# Altium schematic sheet vesc_mcu.SchDoc
size A4; SheetNumber: 2; SheetTotal: 5
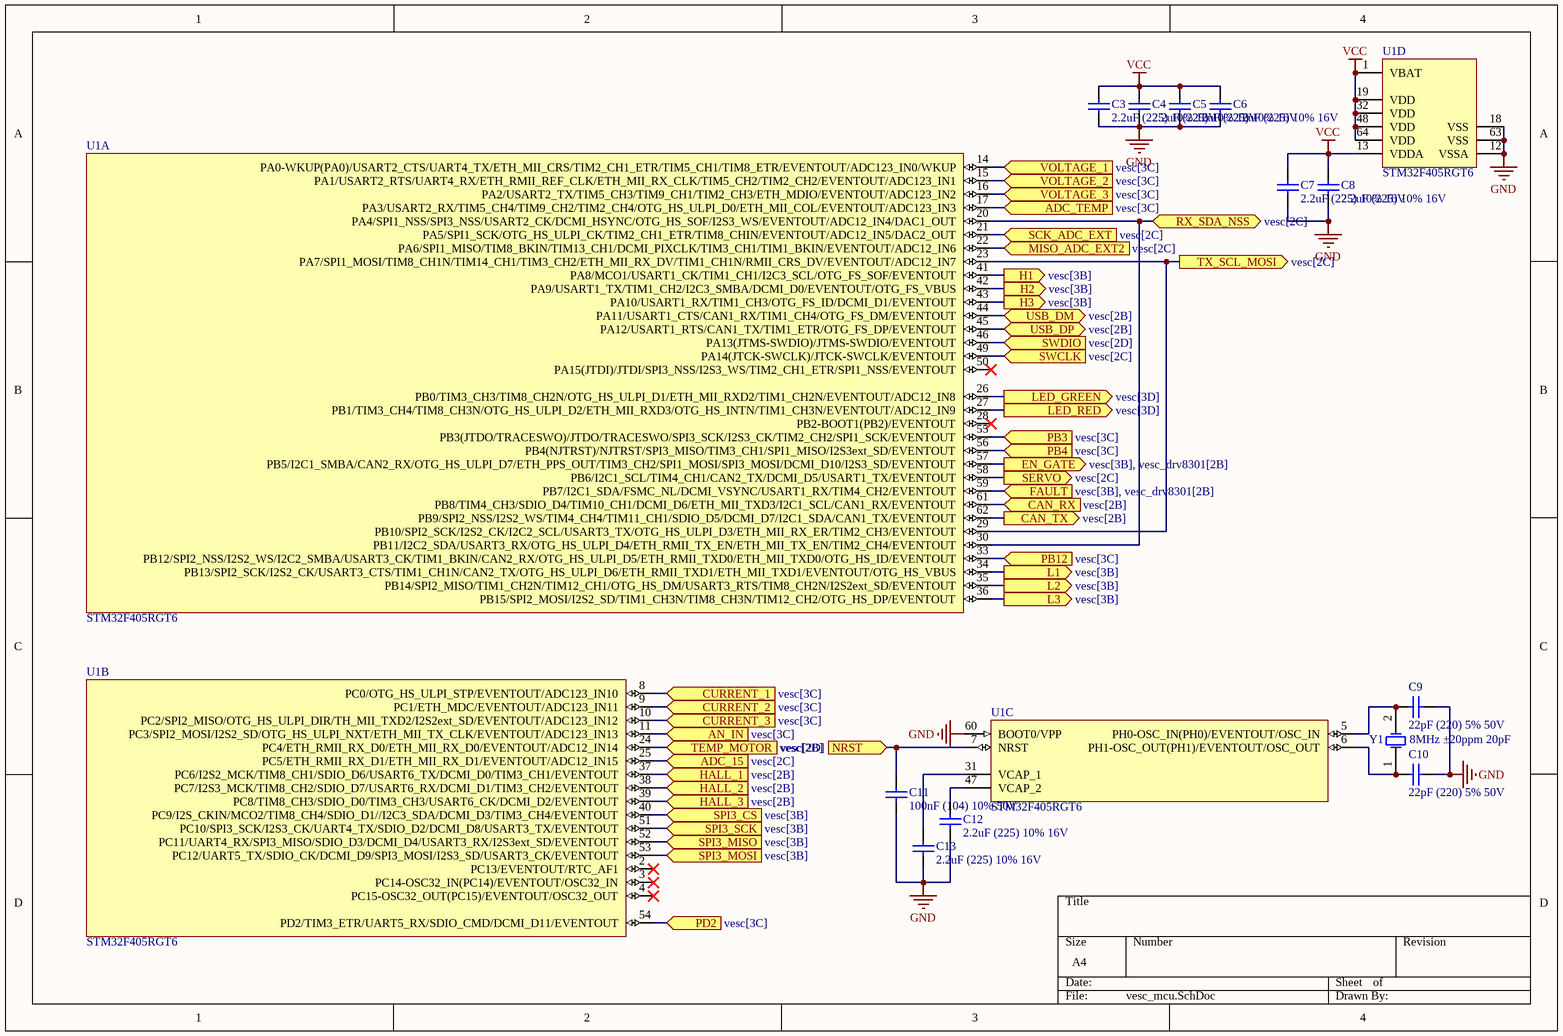
[diagram p0: vesc_mcu.SchDoc]

## Parts
C3  2.2uF (225) 10% 16V  [0603_C]
C4  2.2uF (225) 10% 16V  [0603_C]
C5  2.2uF (225) 10% 16V  [0603_C]
C6  2.2uF (225) 10% 16V  [0603_C]
C7  2.2uF (225) 10% 16V  [0603_C]
C8  2.2uF (225) 10% 16V  [0603_C]
C9  22pF (220) 5% 50V  [0603_C]
C10  22pF (220) 5% 50V  [0603_C]
C11  100nF (104) 10% 50V  [0603_C]
C12  2.2uF (225) 10% 16V  [0603_C]
C13  2.2uF (225) 10% 16V  [0603_C]
U1  STM32F405RGT6  [LQFP-64_10x10x05P]  (parts A,B,C,D of 4)
Y1  8MHz ±20ppm 20pF  [SMD-5032_2P]

## Ports
ADC_15 (in, see vesc[2C]), ADC_TEMP (in, see vesc[3C]), AN_IN (in, see vesc[3C]), CAN_RX (in, see vesc[2B]), CAN_TX (out, see vesc[2B]), CURRENT_1 (in, see vesc[3C]), CURRENT_2 (in, see vesc[3C]), CURRENT_3 (in, see vesc[3C]), EN_GATE (out, see vesc[3B], vesc_drv8301[2B]), FAULT (in, see vesc[3B], vesc_drv8301[2B]), H1 (out, see vesc[3B]), H2 (out, see vesc[3B]), H3 (out, see vesc[3B]), HALL_1 (in, see vesc[2B]), HALL_2 (in, see vesc[2B]), HALL_3 (in, see vesc[2B]), L1 (out, see vesc[3B]), L2 (out, see vesc[3B]), L3 (out, see vesc[3B]), LED_GREEN (out, see vesc[3D]), LED_RED (out, see vesc[3D]), MISO_ADC_EXT2 (in, see vesc[2C]), NRST (in, see vesc[2D]), PB3 (in, see vesc[3C]), PB4 (in, see vesc[3C]), PB12 (in, see vesc[3C]), PD2 (in, see vesc[3C]), RX_SDA_NSS (bidir, see vesc[2C]), SCK_ADC_EXT (in, see vesc[2C]), SERVO (out, see vesc[2C]), SPI3_CS (in, see vesc[3B]), SPI3_MISO (in, see vesc[3B]), SPI3_MOSI (in, see vesc[3B]), SPI3_SCK (in, see vesc[3B]), SWCLK (in, see vesc[2C]), SWDIO (in, see vesc[2D]), TEMP_MOTOR (in, see vesc[2B]), TX_SCL_MOSI (out, see vesc[2C]), USB_DM (bidir, see vesc[2B]), USB_DP (bidir, see vesc[2B]), VOLTAGE_1 (in, see vesc[3C]), VOLTAGE_2 (in, see vesc[3C]), VOLTAGE_3 (in, see vesc[3C])

## Nets
GND: C3.1 C4.1 C5.1 C6.1 C7.1 C8.1 C9.2 C10.2 C11.1 C12.1 C13.1 U1.12(VSSA) U1.18(VSS) U1.60(BOOT0/VPP) U1.63(VSS)
VCC: C3.2 C4.2 C5.2 C6.2 C7.2 C8.2 U1.1(VBAT) U1.13(VDDA) U1.19(VDD) U1.32(VDD) U1.48(VDD) U1.64(VDD)
ADC_15: U1.25(PC5/ETH_RMII_RX_D1/ETH_MII_RX_D1/EVENTOUT/ADC12_IN15) ; port ADC_15
ADC_TEMP: U1.17(PA3/USART2_RX/TIM5_CH4/TIM9_CH2/TIM2_CH4/OTG_HS_ULPI_D0/ETH_MII_COL/EVENTOUT/ADC123_IN3) ; port ADC_TEMP
AN_IN: U1.11(PC3/SPI2_MOSI/I2S2_SD/OTG_HS_ULPI_NXT/ETH_MII_TX_CLK/EVENTOUT/ADC123_IN13) ; port AN_IN
CAN_RX: U1.61(PB8/TIM4_CH3/SDIO_D4/TIM10_CH1/DCMI_D6/ETH_MII_TXD3/I2C1_SCL/CAN1_RX/EVENTOUT) ; port CAN_RX
CAN_TX: U1.62(PB9/SPI2_NSS/I2S2_WS/TIM4_CH4/TIM11_CH1/SDIO_D5/DCMI_D7/I2C1_SDA/CAN1_TX/EVENTOUT) ; port CAN_TX
CURRENT_1: U1.8(PC0/OTG_HS_ULPI_STP/EVENTOUT/ADC123_IN10) ; port CURRENT_1
CURRENT_2: U1.9(PC1/ETH_MDC/EVENTOUT/ADC123_IN11) ; port CURRENT_2
CURRENT_3: U1.10(PC2/SPI2_MISO/OTG_HS_ULPI_DIR/TH_MII_TXD2/I2S2ext_SD/EVENTOUT/ADC123_IN12) ; port CURRENT_3
EN_GATE: U1.57(PB5/I2C1_SMBA/CAN2_RX/OTG_HS_ULPI_D7/ETH_PPS_OUT/TIM3_CH2/SPI1_MOSI/SPI3_MOSI/DCMI_D10/I2S3_SD/EVENTOUT) ; port EN_GATE
FAULT: U1.59(PB7/I2C1_SDA/FSMC_NL/DCMI_VSYNC/USART1_RX/TIM4_CH2/EVENTOUT) ; port FAULT
H1: U1.41(PA8/MCO1/USART1_CK/TIM1_CH1/I2C3_SCL/OTG_FS_SOF/EVENTOUT) ; port H1
H2: U1.42(PA9/USART1_TX/TIM1_CH2/I2C3_SMBA/DCMI_D0/EVENTOUT/OTG_FS_VBUS) ; port H2
H3: U1.43(PA10/USART1_RX/TIM1_CH3/OTG_FS_ID/DCMI_D1/EVENTOUT) ; port H3
HALL_1: U1.37(PC6/I2S2_MCK/TIM8_CH1/SDIO_D6/USART6_TX/DCMI_D0/TIM3_CH1/EVENTOUT) ; port HALL_1
HALL_2: U1.38(PC7/I2S3_MCK/TIM8_CH2/SDIO_D7/USART6_RX/DCMI_D1/TIM3_CH2/EVENTOUT) ; port HALL_2
HALL_3: U1.39(PC8/TIM8_CH3/SDIO_D0/TIM3_CH3/USART6_CK/DCMI_D2/EVENTOUT) ; port HALL_3
L1: U1.34(PB13/SPI2_SCK/I2S2_CK/USART3_CTS/TIM1_CH1N/CAN2_TX/OTG_HS_ULPI_D6/ETH_RMII_TXD1/ETH_MII_TXD1/EVENTOUT/OTG_HS_VBUS) ; port L1
L2: U1.35(PB14/SPI2_MISO/TIM1_CH2N/TIM12_CH1/OTG_HS_DM/USART3_RTS/TIM8_CH2N/I2S2ext_SD/EVENTOUT) ; port L2
L3: U1.36(PB15/SPI2_MOSI/I2S2_SD/TIM1_CH3N/TIM8_CH3N/TIM12_CH2/OTG_HS_DP/EVENTOUT) ; port L3
LED_GREEN: U1.26(PB0/TIM3_CH3/TIM8_CH2N/OTG_HS_ULPI_D1/ETH_MII_RXD2/TIM1_CH2N/EVENTOUT/ADC12_IN8) ; port LED_GREEN
LED_RED: U1.27(PB1/TIM3_CH4/TIM8_CH3N/OTG_HS_ULPI_D2/ETH_MII_RXD3/OTG_HS_INTN/TIM1_CH3N/EVENTOUT/ADC12_IN9) ; port LED_RED
MISO_ADC_EXT2: U1.22(PA6/SPI1_MISO/TIM8_BKIN/TIM13_CH1/DCMI_PIXCLK/TIM3_CH1/TIM1_BKIN/EVENTOUT/ADC12_IN6) ; port MISO_ADC_EXT2
NRST: C11.2 U1.7(NRST) ; port NRST
PB3: U1.55(PB3(JTDO/TRACESWO)/JTDO/TRACESWO/SPI3_SCK/I2S3_CK/TIM2_CH2/SPI1_SCK/EVENTOUT) ; port PB3
PB4: U1.56(PB4(NJTRST)/NJTRST/SPI3_MISO/TIM3_CH1/SPI1_MISO/I2S3ext_SD/EVENTOUT) ; port PB4
PB12: U1.33(PB12/SPI2_NSS/I2S2_WS/I2C2_SMBA/USART3_CK/TIM1_BKIN/CAN2_RX/OTG_HS_ULPI_D5/ETH_RMII_TXD0/ETH_MII_TXD0/OTG_HS_ID/EVENTOUT) ; port PB12
PD2: U1.54(PD2/TIM3_ETR/UART5_RX/SDIO_CMD/DCMI_D11/EVENTOUT) ; port PD2
RX_SDA_NSS: U1.20(PA4/SPI1_NSS/SPI3_NSS/USART2_CK/DCMI_HSYNC/OTG_HS_SOF/I2S3_WS/EVENTOUT/ADC12_IN4/DAC1_OUT) U1.30(PB11/I2C2_SDA/USART3_RX/OTG_HS_ULPI_D4/ETH_RMII_TX_EN/ETH_MII_TX_EN/TIM2_CH4/EVENTOUT) ; port RX_SDA_NSS
SCK_ADC_EXT: U1.21(PA5/SPI1_SCK/OTG_HS_ULPI_CK/TIM2_CH1_ETR/TIM8_CHIN/EVENTOUT/ADC12_IN5/DAC2_OUT) ; port SCK_ADC_EXT
SERVO: U1.58(PB6/I2C1_SCL/TIM4_CH1/CAN2_TX/DCMI_D5/USART1_TX/EVENTOUT) ; port SERVO
SPI3_CS: U1.40(PC9/I2S_CKIN/MCO2/TIM8_CH4/SDIO_D1//I2C3_SDA/DCMI_D3/TIM3_CH4/EVENTOUT) ; port SPI3_CS
SPI3_MISO: U1.52(PC11/UART4_RX/SPI3_MISO/SDIO_D3/DCMI_D4/USART3_RX/I2S3ext_SD/EVENTOUT) ; port SPI3_MISO
SPI3_MOSI: U1.53(PC12/UART5_TX/SDIO_CK/DCMI_D9/SPI3_MOSI/I2S3_SD/USART3_CK/EVENTOUT) ; port SPI3_MOSI
SPI3_SCK: U1.51(PC10/SPI3_SCK/I2S3_CK/UART4_TX/SDIO_D2/DCMI_D8/USART3_TX/EVENTOUT) ; port SPI3_SCK
SWCLK: U1.49(PA14(JTCK-SWCLK)/JTCK-SWCLK/EVENTOUT) ; port SWCLK
SWDIO: U1.46(PA13(JTMS-SWDIO)/JTMS-SWDIO/EVENTOUT) ; port SWDIO
TEMP_MOTOR: U1.24(PC4/ETH_RMII_RX_D0/ETH_MII_RX_D0/EVENTOUT/ADC12_IN14) ; port TEMP_MOTOR
TX_SCL_MOSI: U1.23(PA7/SPI1_MOSI/TIM8_CH1N/TIM14_CH1/TIM3_CH2/ETH_MII_RX_DV/TIM1_CH1N/RMII_CRS_DV/EVENTOUT/ADC12_IN7) U1.29(PB10/SPI2_SCK/I2S2_CK/I2C2_SCL/USART3_TX/OTG_HS_ULPI_D3/ETH_MII_RX_ER/TIM2_CH3/EVENTOUT) ; port TX_SCL_MOSI
USB_DM: U1.44(PA11/USART1_CTS/CAN1_RX/TIM1_CH4/OTG_FS_DM/EVENTOUT) ; port USB_DM
USB_DP: U1.45(PA12/USART1_RTS/CAN1_TX/TIM1_ETR/OTG_FS_DP/EVENTOUT) ; port USB_DP
VOLTAGE_1: U1.14(PA0-WKUP(PA0)/USART2_CTS/UART4_TX/ETH_MII_CRS/TIM2_CH1_ETR/TIM5_CH1/TIM8_ETR/EVENTOUT/ADC123_IN0/WKUP) ; port VOLTAGE_1
VOLTAGE_2: U1.15(PA1/USART2_RTS/UART4_RX/ETH_RMII_REF_CLK/ETH_MII_RX_CLK/TIM5_CH2/TIM2_CH2/EVENTOUT/ADC123_IN1) ; port VOLTAGE_2
VOLTAGE_3: U1.16(PA2/USART2_TX/TIM5_CH3/TIM9_CH1/TIM2_CH3/ETH_MDIO/EVENTOUT/ADC123_IN2) ; port VOLTAGE_3
NetC9_1: C9.1 U1.5(PH0-OSC_IN(PH0)/EVENTOUT/OSC_IN) Y1.2(OSC2)
NetC10_1: C10.1 U1.6(PH1-OSC_OUT(PH1)/EVENTOUT/OSC_OUT) Y1.1(OSC1)
NetC12_2: C12.2 U1.47(VCAP_2)
NetC13_2: C13.2 U1.31(VCAP_1)

Not connected (* = marked no-connect by the designer): U1 2(PC13/EVENTOUT/RTC_AF1)* 3(PC14-OSC32_IN(PC14)/EVENTOUT/OSC32_IN)* 4(PC15-OSC32_OUT(PC15)/EVENTOUT/OSC32_OUT)* 28(PB2-BOOT1(PB2)/EVENTOUT)* 50(PA15(JTDI)/JTDI/SPI3_NSS/I2S3_WS/TIM2_CH1_ETR/SPI1_NSS/EVENTOUT)*

## Library data of the parts
C3-C8 C12 C13 = 0603 2.2uF (225) 10% 16V: 贴片电容; ComponentLink1Description: 供应商链接; ComponentLink1URL: http://www.szlcsc.com/product/details_24366.html; Package: 0603; Supplier: LC; SuppliersPartNumber: C23630
C9 C10 = 0603 22pF (220) 5% 50V: 贴片电容; ComponentLink1Description: 供应商链接; ComponentLink1URL: http://www.szlcsc.com/product/details_2005.html; Package: 0603; Supplier: LC; SuppliersPartNumber: C1653
C11 = 0603 100nF (104) 10% 50V: 贴片电容; ComponentLink1Description: 供应商链接; ComponentLink1URL: http://www.szlcsc.com/product/details_15331.html; Package: 0603; Supplier: LC; SuppliersPartNumber: C14663
U1 = STM32F405RGT6: ARM; ComponentLink1Description: 供应商链接; ComponentLink1URL: http://www.szlcsc.com/product/details_16424.html; Package: LQFP-64_10x10x05P; Supplier: LC; SuppliersPartNumber: C15742
Y1 = SMD-5032_2P 8MHz 20ppm 20pF: 贴片晶振; ComponentLink1Description: 供应商链接; ComponentLink1URL: http://www.szlcsc.com/product/details_117214.html; Package: SMD-5032_2P; Supplier: LC; SuppliersPartNumber: C115962